# EAGLE schematic Main_PCB_Schematic (EAGLE 9.7.0)
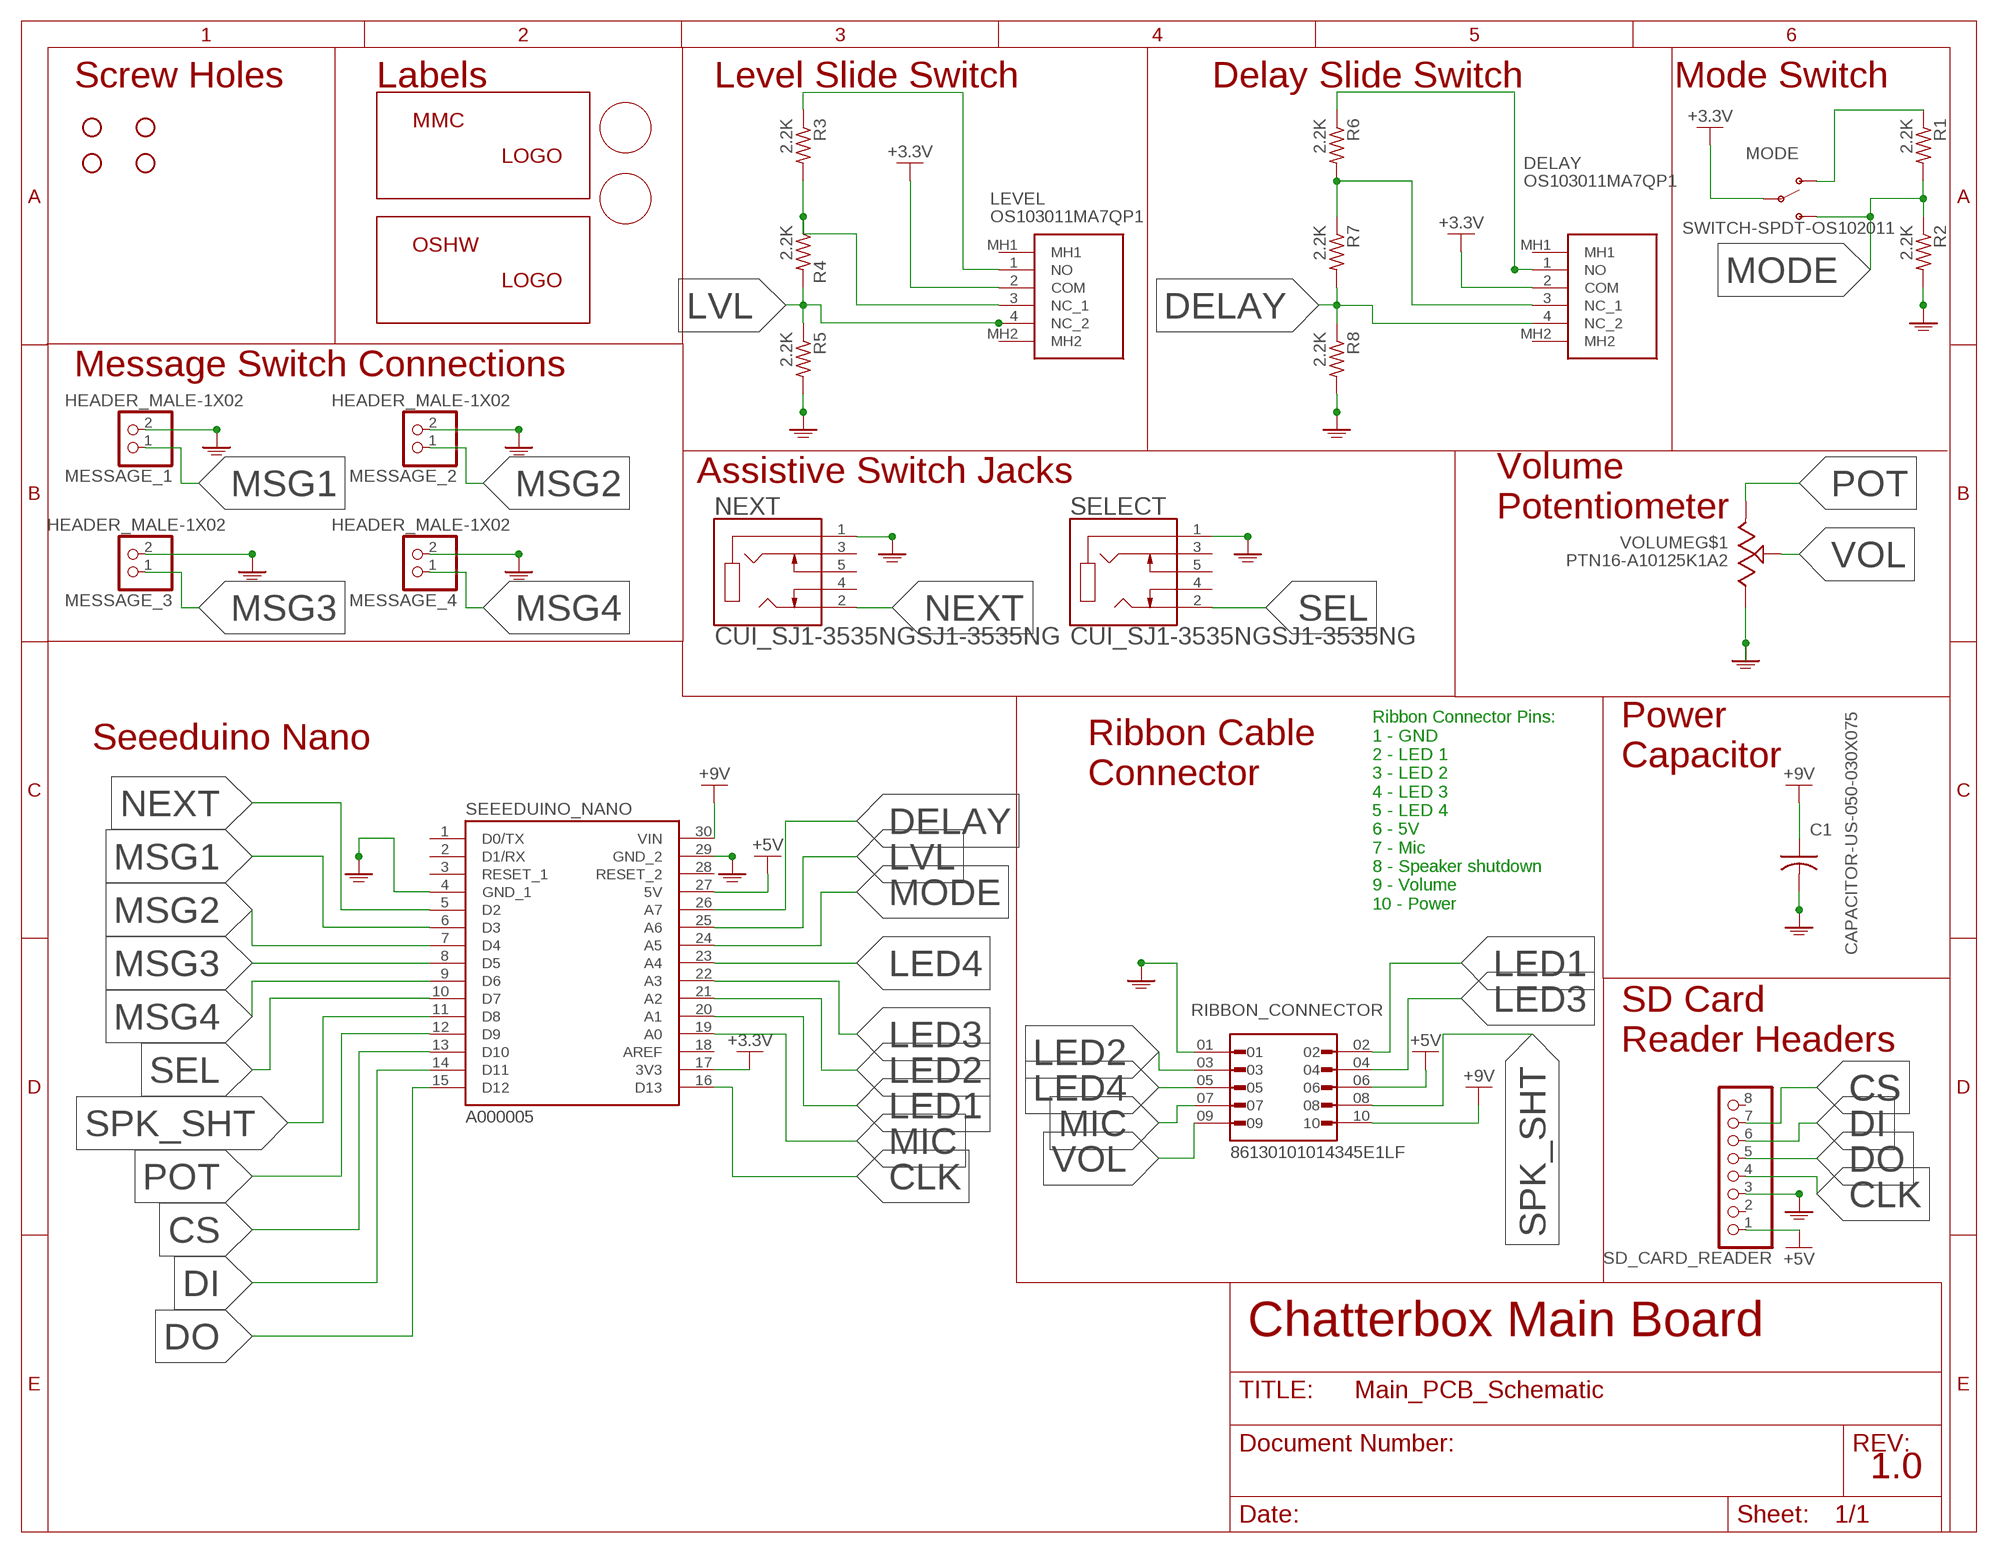
[diagram p0: schematic, sheet 1]

## Parts
C1  CAPACITOR-US-050-030X075  [CAP-050-030X075]
DELAY  OS103011MA7QP1  [OS103011MA7QP1]
LEVEL  OS103011MA7QP1  [OS103011MA7QP1]
MESSAGE_1  HEADER_MALE-1X02  [HEADER_MALE-1X02]
MESSAGE_2  HEADER_MALE-1X02  [HEADER_MALE-1X02]
MESSAGE_3  HEADER_MALE-1X02  [HEADER_MALE-1X02]
MESSAGE_4  HEADER_MALE-1X02  [HEADER_MALE-1X02]
MODE  SWITCH-SPDT-OS102011  [SWITCH_SPDT_11MA1QS1]
NEXT  CUI_SJ1-3535NGSJ1-3535NG  [CUI_SJ1-3535NG]
R1  2.2K  R-US_0309/12  [0309/12]
R2  2.2K  R-US_0309/12  [0309/12]
R3  2.2K  R-US_0309/12  [0309/12]
R4  2.2K  R-US_0309/12  [0309/12]
R5  2.2K  R-US_0309/12  [0309/12]
R6  2.2K  R-US_0309/12  [0309/12]
R7  2.2K  R-US_0309/12  [0309/12]
R8  2.2K  R-US_0309/12  [0309/12]
RIBBON_CONNECTOR  86130101014345E1LF  [AMPHENOL_86130101014345E1LF]
SD_CARD_READER  HEADER_MALE-1X8  [1X08_OVAL]
SEEEDUINO_NANO  A000005  [MODULE_A000005]
SELECT  CUI_SJ1-3535NGSJ1-3535NG  [CUI_SJ1-3535NG]
U$1  MMC_LOGO-SM  [MMC_SMALL_LOGO]
U$2  OSHW_LOGO-SM  [OSHW_SMALL_LOGO]
U$3  MMC_LABEL-FRONT  [LABEL-FRONT]
U$4  STAND-OFF-  [STAND-OFF]
U$5  MMC_LABEL-BACK  [LABEL-BACK]
U$10  STAND-OFF-  [STAND-OFF]
U$11  STAND-OFF-  [STAND-OFF]
U$12  STAND-OFF-  [STAND-OFF]
VOLUME  PTN16-A10125K1A2  [POT_PTN16-A10125K1A2]

## Nets
+3.3V: DELAY.2(COM) LEVEL.2(COM) MODE.2(P) SEEEDUINO_NANO.17(3V3)
+5V: RIBBON_CONNECTOR.06 SD_CARD_READER.1 SEEEDUINO_NANO.27(5V)
+9V: C1.1 RIBBON_CONNECTOR.10 SEEEDUINO_NANO.30(VIN)
CLK: SD_CARD_READER.4 SEEEDUINO_NANO.16(D13)
CS: SD_CARD_READER.7 SEEEDUINO_NANO.13(D10)
DELAY: DELAY.4(NC_2) R7.2 R8.1 SEEEDUINO_NANO.26(A7)
DI: SD_CARD_READER.6 SEEEDUINO_NANO.14(D11)
DO: SD_CARD_READER.5 SEEEDUINO_NANO.15(D12)
GND1: C1.2 MESSAGE_1.2 MESSAGE_2.2 MESSAGE_3.2 MESSAGE_4.2 NEXT.1 R2.2 R5.2 R8.2 RIBBON_CONNECTOR.01 SD_CARD_READER.3 SEEEDUINO_NANO.4(GND_1) SEEEDUINO_NANO.29(GND_2) SELECT.1 VOLUME.R1_1 ; supply symbol labelled GND
LED1: RIBBON_CONNECTOR.02 SEEEDUINO_NANO.20(A1)
LED2: RIBBON_CONNECTOR.03 SEEEDUINO_NANO.21(A2)
LED3: RIBBON_CONNECTOR.04 SEEEDUINO_NANO.22(A3)
LED4: RIBBON_CONNECTOR.05 SEEEDUINO_NANO.23(A4)
LVL: LEVEL.4(NC_2) R4.2 R5.1 SEEEDUINO_NANO.25(A6)
MIC: RIBBON_CONNECTOR.07 SEEEDUINO_NANO.19(A0)
MODE: MODE.3(S) R1.2 R2.1 SEEEDUINO_NANO.24(A5)
MSG1: MESSAGE_1.1 SEEEDUINO_NANO.6(D3)
MSG2: MESSAGE_2.1 SEEEDUINO_NANO.7(D4)
MSG3: MESSAGE_3.1 SEEEDUINO_NANO.8(D5)
MSG4: MESSAGE_4.1 SEEEDUINO_NANO.9(D6)
N$22: MODE.1(O) R1.1
N$24: LEVEL.1(NO) R3.1
N$25: LEVEL.3(NC_1) R3.2 R4.1
N$27: DELAY.1(NO) R6.1
N$30: DELAY.3(NC_1) R6.2 R7.1
NEXT: NEXT.2 SEEEDUINO_NANO.5(D2)
POT: SEEEDUINO_NANO.12(D9) VOLUME.R1_3
SEL: SEEEDUINO_NANO.10(D7) SELECT.2
SPK_SHT: RIBBON_CONNECTOR.08 SEEEDUINO_NANO.11(D8)
VOL: RIBBON_CONNECTOR.09 VOLUME.R1_2
Unconnected: DELAY.MH1 DELAY.MH2 LEVEL.MH1 LEVEL.MH2 NEXT.3 NEXT.4 NEXT.5 SD_CARD_READER.2 SD_CARD_READER.8 SEEEDUINO_NANO.1(D0/TX) SEEEDUINO_NANO.2(D1/RX) SEEEDUINO_NANO.3(RESET_1) SEEEDUINO_NANO.18(AREF) SEEEDUINO_NANO.28(RESET_2) SELECT.3 SELECT.4 SELECT.5 VOLUME.R2_1 VOLUME.R2_2 VOLUME.R2_3

## Notes on the sheet
- Screw Holes | Labels | Level Slide Switch | Delay Slide Switch | Mode Switch
- Message Switch Connections
- Assistive Switch Jacks
- Volume
  Potentiometer
- Seeeduino Nano
- Power
  Capacitor
- Ribbon Cable
  Connector
- Ribbon Connector Pins:
  1 - GND
  2 - LED 1
  3 - LED 2
  4 - LED 3
  5 - LED 4
  6 - 5V
  7 - Mic
  8 - Speaker shutdown
  9 - Volume
  10 - Power
- SD Card
  Reader Headers
- Chatterbox Main Board
- 1.0

## Library data of the parts
C1 = MMC_Electronics_Library:CAPACITOR-US-
DELAY LEVEL = OS103011MA7QP1:OS103011MA7QP1: Switch Slide ON ON ON SP3T Side Slide 0.1A 12VDC 10000Cycles PC Pins Bracket Mount/Through Hole Bulk Source: Datasheet <https://www.ckswitches.com/media/1428/os.pdf>; ARROW_PART_NUMBER: OS103011MA7QP1; ARROW_PRICE-STOCK: https://www.arrow.com/en/products/os103011ma7qp1/ck?region=europe; DESCRIPTION: Switch Slide ON ON ON SP3T Side Slide 0.1A 12VDC 10000Cycles PC Pins Bracket Mount/Through Hole Bulk; HEIGHT: 4.7mm; MANUFACTURER_NAME: C & K COMPONENTS; MANUFACTURER_PART_NUMBER: OS103011MA7QP1; MOUSER_PART_NUMBER: 611-OS103011MA7QP1; MOUSER_PRICE-STOCK: https://www.mouser.co.uk/ProductDetail/CK/OS103011MA7QP1?qs=WtljUlYws5SZzmleoPXX2w%3D%3D
MESSAGE_1-MESSAGE_4 = MMC_Electronics_Library:HEADER_MALE-1X02
MODE = MMC_Eagle:SWITCH-SPDT-
NEXT SELECT = MMC_Eagle:CUI_SJ1-3535NG: SJ1-3535NG 3.50mm (0.141", 1/8", Mini Plug) - Headphone Phone Jack Stereo (3 Conductor, TRS) Connector. You can use these as jacks to create simple switch interfaces. Options: Digikey - CP1-3535NG-ND <https://www.digikey.ca/en/products/detail/cui-devices/SJ1-3535NG/738699> Mouser - 490-SJ1-3535NG <https://www.mouser.ca/ProductDetail/CUI-Devices/SJ1-3535NG?qs=WyjlAZoYn50jUmKVsqeRJw%3D%3D>
R1-R8 = adafruit:R-US_: RESISTOR, American symbol
RIBBON_CONNECTOR = 86130101014345E1LF:86130101014345E1LF; MANUFACTURER: Amphenol; PARTREV: C; STANDARD: Manufacturer Recommendations
SD_CARD_READER = MMC_Eagle:HEADER_MALE-1X8: PIN HEADER
SEEEDUINO_NANO = A000005:A000005; MANUFACTURER: Arduino; MAXIMUM_PACKAGE_HEIGHT: N/A; PARTREV: 23/03/2020; STANDARD: Manufacturer Recommendations
U$1 = MMC_Eagle:MMC_LOGO-
U$2 = MMC_Eagle:OSHW_LOGO-
U$3 U$5 = MMC_Eagle:MMC_LABEL-
U$4 U$10-U$12 = MMC_Eagle:STAND-OFF-
VOLUME = PTN16-A10125K1A2:PTN16-A10125K1A2; MANUFACTURER: CUI Devices; MAXIMUM_PACKAGE_HEIGHT: 21.5mm; PARTREV: 1.0; STANDARD: Manufacturer Recommendations